# Altium schematic sheet GYRO 3-AXIS - ITG-3200.SchDoc: Gyroscope, 3-Axis - I2C
size A4; Organization: Altium Limited; Address1: 3 Minna Close; Address2: Belrose; Address3: NSW 2085; Address4: Australia
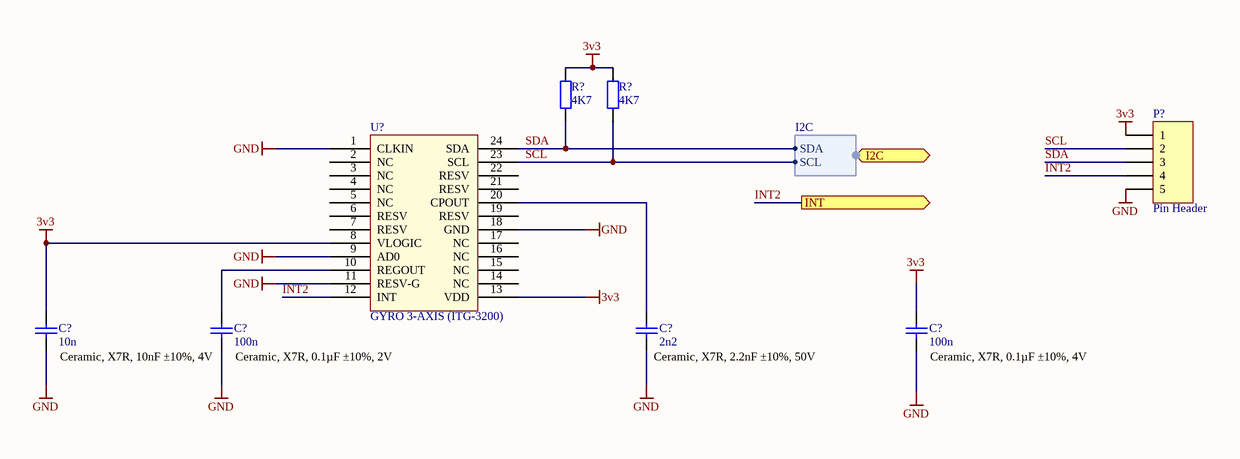
[diagram p0: GYRO 3-AXIS - ITG-3200.SchDoc]

## Parts
(Parts that share a designator on the sheet are numbered #1, #2 ... from top to bottom, then left to right.)
C?#1  10n  [C0805]
C?#2  100n  [C0805]
C?#3  2n2  [C0805]
C?#4  100n  [C0805]
P?  Pin Header  [PH1x5_2.54]
R?#1  value 4K7  [R0805]  (hidden comment: RESISTOR)
R?#2  value 4K7  [R0805]  (hidden comment: RESISTOR)
U?  GYRO 3-AXIS (ITG-3200)  [QFN50P400X400-24V2M - GYRO 3axis]

## Ports
I2C (harness I2C), INT (out)

## Harnesses
I2C: SDA, SCL

## Nets
3v3: C?#1.2 C?#4.2 P?.1 R?#1.1 R?#2.1 U?.8(VLOGIC) U?.13(VDD)
GND: C?#1.1 C?#2.1 C?#3.1 C?#4.1 P?.5 U?.1(CLKIN) U?.9(AD0) U?.11(RESV-G) U?.18(GND)
INT2: P?.4 U?.12(INT) ; port INT
SCL: P?.2 R?#2.2 U?.23(SCL) ; port I2C.SCL
SDA: P?.3 R?#1.2 U?.24(SDA) ; port I2C.SDA
NetC?#2_2: C?#2.2 U?.10(REGOUT)
NetC?#3_2: C?#3.2 U?.20(CPOUT)

Not connected (* = marked no-connect by the designer): U? 2(NC) 3(NC) 4(NC) 5(NC) 6(RESV) 7(RESV) 14(NC) 15(NC) 16(NC) 17(NC) 19(RESV) 21(RESV) 22(RESV)

## Notes on the sheet
- (near C?#2) Ceramic, X7R, 10nF ±10%, 4V
- (near C?#2) Ceramic, X7R, 0.1µF ±10%, 2V
- (near C?#3) Ceramic, X7R, 2.2nF ±10%, 50V
- (near C?#4) Ceramic, X7R, 0.1µF ±10%, 4V
- Disclaimer
  Any design and information, hardware or software  is provided on an "as-is" basis without warranty of any kind and any express or implied warranties, including, but not limited to, the implied warranties of merchantability and fitness for a particular purpose are disclaimed. In no event shall wnpd (or KeaDrone)be liable for any direct, indirect, incidental, special, exemplary, or consequential damages (including, but not limited to, procurement of substitute goods or services; loss of use, data, or profits; or business interruption) however caused and on any theory of liability, whether in contract, strict liability, or tort (including negligence or otherwise) arising in any way out of the use of this firmware, hardware, software or information, even if wnpd (or KeaDrone) has been advised by user of the possibility of such potential loss or damage. The user agrees to hold wnpd (or KeaDrone) harmless from and against any and all claims, losses, liabilities and expenses.
- Title
- Size:
- Date:
- A4
- Name:
- Time:
- Ing. W. Pietersz
- Revision:
- Sheet
- of
- WillyPietersz@gmail.com
- Contact:
- -
- www.wnpd.nl
- File:

## Library data of the parts
C?#1 = 10n: Tolerance: 0.1; LatestRevision Note: Initial Release; Part Number: 10n; Value: 10n; Package: 0805; Component Type: Standard; LatestRevision Date: 31-7-2010; Author: Willy Pietersz; ComponentLink1Description: Manufacturer; ComponentLink2Description: Datasheet
C?#2 C?#4 = 100n: Tolerance: 0.1; LatestRevision Note: Initial Release; Part Number: 100n; Value: 100n; Package: 0805; Component Type: Standard; LatestRevision Date: 31-7-2010; Author: Willy Pietersz; Supplier 2: Farnell; Supplier Part Number 2: 1759266; ComponentLink1Description: Manufacturer; ComponentLink2Description: Datasheet
C?#3 = 2n2: Tolerance: 0.1; LatestRevision Note: Initial Release; Part Number: 2n2; Value: 2n2; Package: 0805; Component Type: Standard; LatestRevision Date: 31-7-2010; Author: Willy Pietersz; ComponentLink1Description: Manufacturer; ComponentLink2Description: Datasheet
P? = PH1x5: Con1x5; Part Number: PH1x5; Pitch: 2.54; LatestRevision Note: Initial Release; Type: Pin Header; Number Of Pins: 5; Component Type: Standard; LatestRevision Date: 23-11-2010; Author: Willy Pietersz; Supplier 2: Farnell
R?#1 R?#2 = 4K7: Manufacturer 1: Panasonic; Manufacturer 1 Part No: ERJT06J472V; Power: 0.25W; Tolerance: 0.05; LatestRevision Note: Initial Release; Published: 8-Jun-2000; LatestRevisionDate: 17-Jul-2002; LatestRevisionNote: Re-released for DXP Platform.; PackageReference: AXIAL-0.4; Publisher: Altium Limited; Part Number: 4K7; Type: Film; Package: 0805; Component Type: Standard; LatestRevision Date: 30-7-2010; Author: Willy Pietersz; ROHS: Y; Supplier 2: Farnell; Supplier Part Number 2: 1577368; ComponentLink1Description: Manufacturer; ComponentLink2Description: Datasheet
U? = ITG-3200: Gyro, 3-axis; Part Number: ITG-3200; Component Type: Sensor; Supplier 1: Sparkfun; Supplier Part Number 1: ITG-3200; ComponentLink1Description: Datasheet; ComponentLink1URL: http://www.sparkfun.com/datasheets/Sensors/Gyro/PS-ITG-3200-00-01.4.pdf